# EAGLE design amplifier_ 6_1_Channel_v0001 (EAGLE 6.4)

## Sheet 1 of 3: Amp - Front
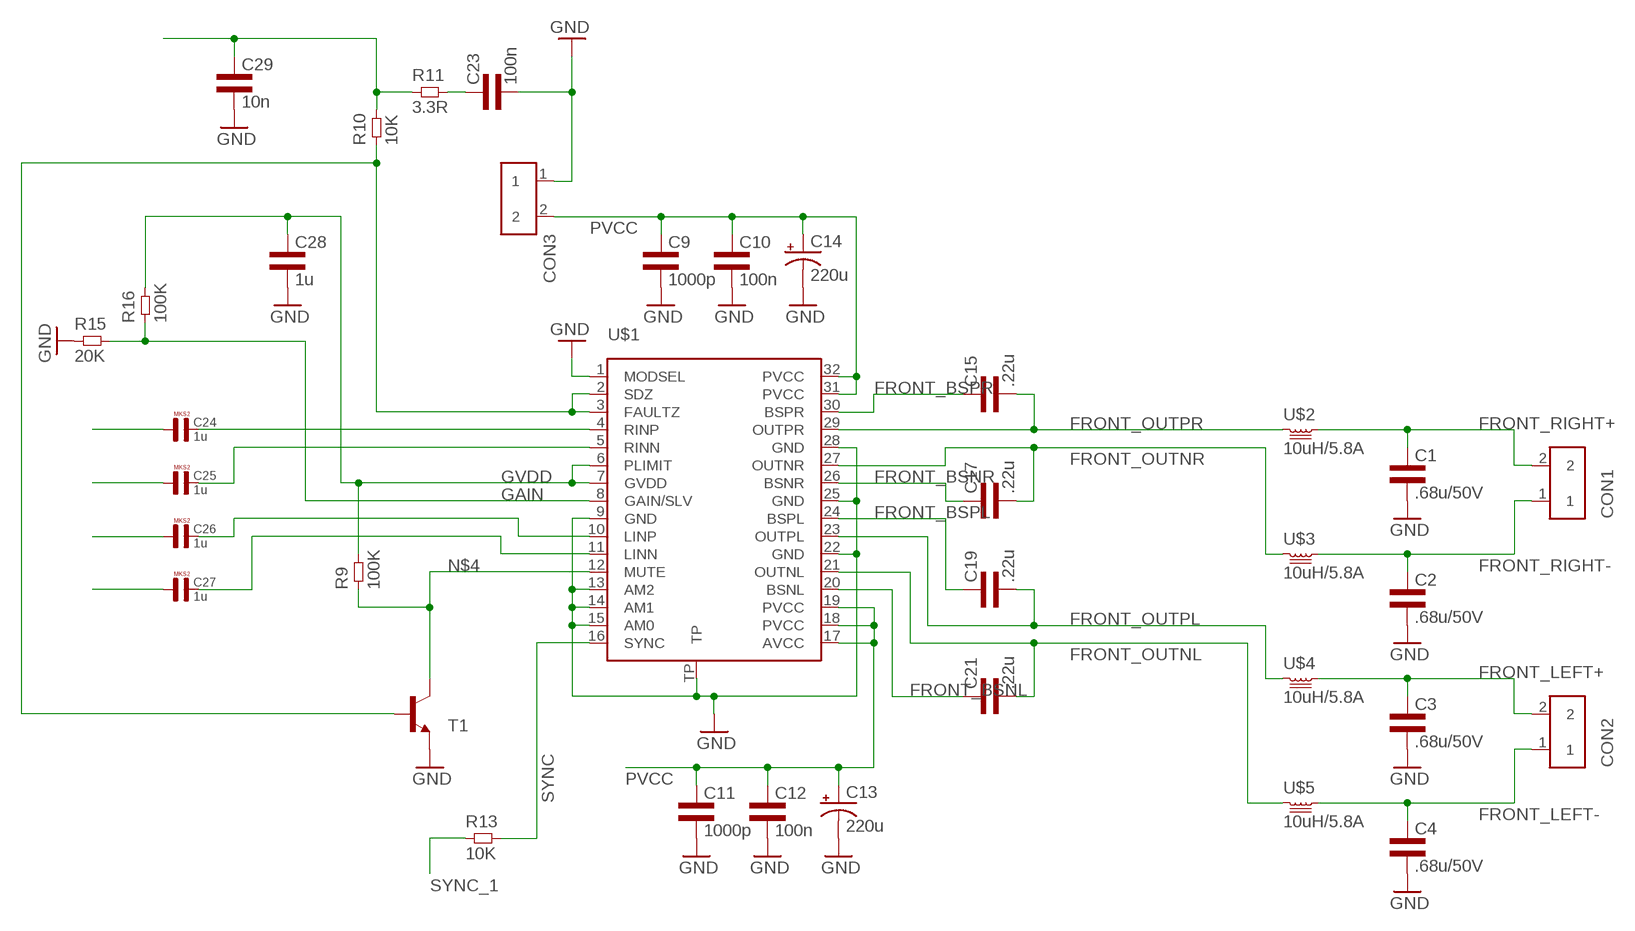
[diagram p0: schematic, sheet 1]

### Parts
C1  .68u/50V  CAP1206L3  [1206L3]
C2  .68u/50V  CAP1206L3  [1206L3]
C3  .68u/50V  CAP1206L3  [1206L3]
C4  .68u/50V  CAP1206L3  [1206L3]
C9  1000p  CAP0603L3  [0603L3]
C10  100n  CAP0603L3  [0603L3]
C11  1000p  CAP0603L3  [0603L3]
C12  100n  CAP0603L3  [0603L3]
C13  220u  CPOL-USG  [PANASONIC_G]
C14  220u  CPOL-USG  [PANASONIC_G]
C15  .22u  CAP0603L3  [0603L3]
C17  .22u  CAP0603L3  [0603L3]
C19  .22u  CAP0603L3  [0603L3]
C21  .22u  CAP0603L3  [0603L3]
C23  100n  CAP0603L3  [0603L3]
C24  1u  3,3µF  [R5B8K5]
C25  1u  3,3µF  [R5B8K5]
C26  1u  3,3µF  [R5B8K5]
C27  1u  3,3µF  [R5B8K5]
C28  1u  CAP0603L3  [0603L3]
C29  10n  CAP0603L3  [0603L3]
CON1  TERM_BLOCK_2  [TERM_BLOCK_2]
CON2  TERM_BLOCK_2  [TERM_BLOCK_2]
CON3  TERM_BLOCK_2  [TERM_BLOCK_2]
R9  100K  RES0603L3  [0603L3]
R10  10K  RES0603L3  [0603L3]
R11  3.3R  RES0603L3  [0603L3]
R13  10K  RES0603L3  [0603L3]
R15  20K  RES0603L3  [0603L3]
R16  100K  RES0603L3  [0603L3]
T1  TRANSISTOR_MMBT2222ALT1-NPN-SOT23-BEC  [TRANSISTOR_SOT23-BEC]
U$1  TPA3116  [R-PDSO-32]
U$2  10uH/5.8A  INDUCTORDR127  [DR127]
U$3  10uH/5.8A  INDUCTORDR127  [DR127]
U$4  10uH/5.8A  INDUCTORDR127  [DR127]
U$5  10uH/5.8A  INDUCTORDR127  [DR127]

### Nets
FRONT_BSNL: C21.P$1 U$1.20(BSNL)
FRONT_BSNR: C17.P$1 U$1.26(BSNR)
FRONT_BSPL: C19.P$1 U$1.24(BSPL)
FRONT_BSPR: C15.P$1 U$1.30(BSPR)
FRONT_LEFT+: C3.1 CON2.2 U$4.2
FRONT_LEFT-: C4.1 CON2.1 U$5.2
FRONT_OUTNL: C21.P$2 U$1.21(OUTNL) U$5.1
FRONT_OUTNR: C17.P$2 U$1.27(OUTNR) U$3.1
FRONT_OUTPL: C19.P$2 U$1.23(OUTPL) U$4.1
FRONT_OUTPR: C15.P$2 U$1.29(OUTPR) U$2.1
FRONT_RIGHT+: C1.1 CON1.2 U$2.2
FRONT_RIGHT-: C2.1 CON1.1 U$3.2
GAIN: R15.P$2 R16.P$1 U$1.8(GAIN/SLV) ; also sheet 2,3
GND: C1.2 C2.2 C3.2 C4.2 C9.P$2 C10.P$2 C11.P$2 C12.P$2 C13.- C14.- C23.P$2 C28.P$2 C29.P$2 CON3.1 R15.P$1 T1.E U$1.1(MODSEL) U$1.9(GND) U$1.13(AM2) U$1.14(AM1) U$1.15(AM0) U$1.22(GND) U$1.25(GND) U$1.28(GND) U$1.TP ; also sheet 2,3
GVDD: C28.P$1 R9.P$2 R16.P$2 U$1.6(PLIMIT) U$1.7(GVDD) ; also sheet 2,3
MUTE: R10.P$1 T1.B U$1.2(SDZ) U$1.3(FAULTZ) ; also sheet 2,3
N$1: C27.2 U$1.11(LINN)
N$2: C26.2 U$1.10(LINP)
N$3: C24.2 U$1.4(RINP)
N$4: R9.P$1 T1.C U$1.12(MUTE)
N$6: C25.2 U$1.5(RINN)
N$7: C29.P$1 R10.P$2 R11.P$1
N$17: C24.1
N$18: C25.1
N$23: C27.1
N$24: C26.1
N$58: C23.P$1 R11.P$2
PVCC: C9.P$1 C10.P$1 C11.P$1 C12.P$1 C13.+ C14.+ CON3.2 U$1.17(AVCC) U$1.18(PVCC) U$1.19(PVCC) U$1.31(PVCC) U$1.32(PVCC) ; also sheet 2,3
SYNC: R13.P$2 U$1.16(SYNC)
SYNC_1: R13.P$1 ; also sheet 2

## Sheet 2 of 3: Amp - Rear
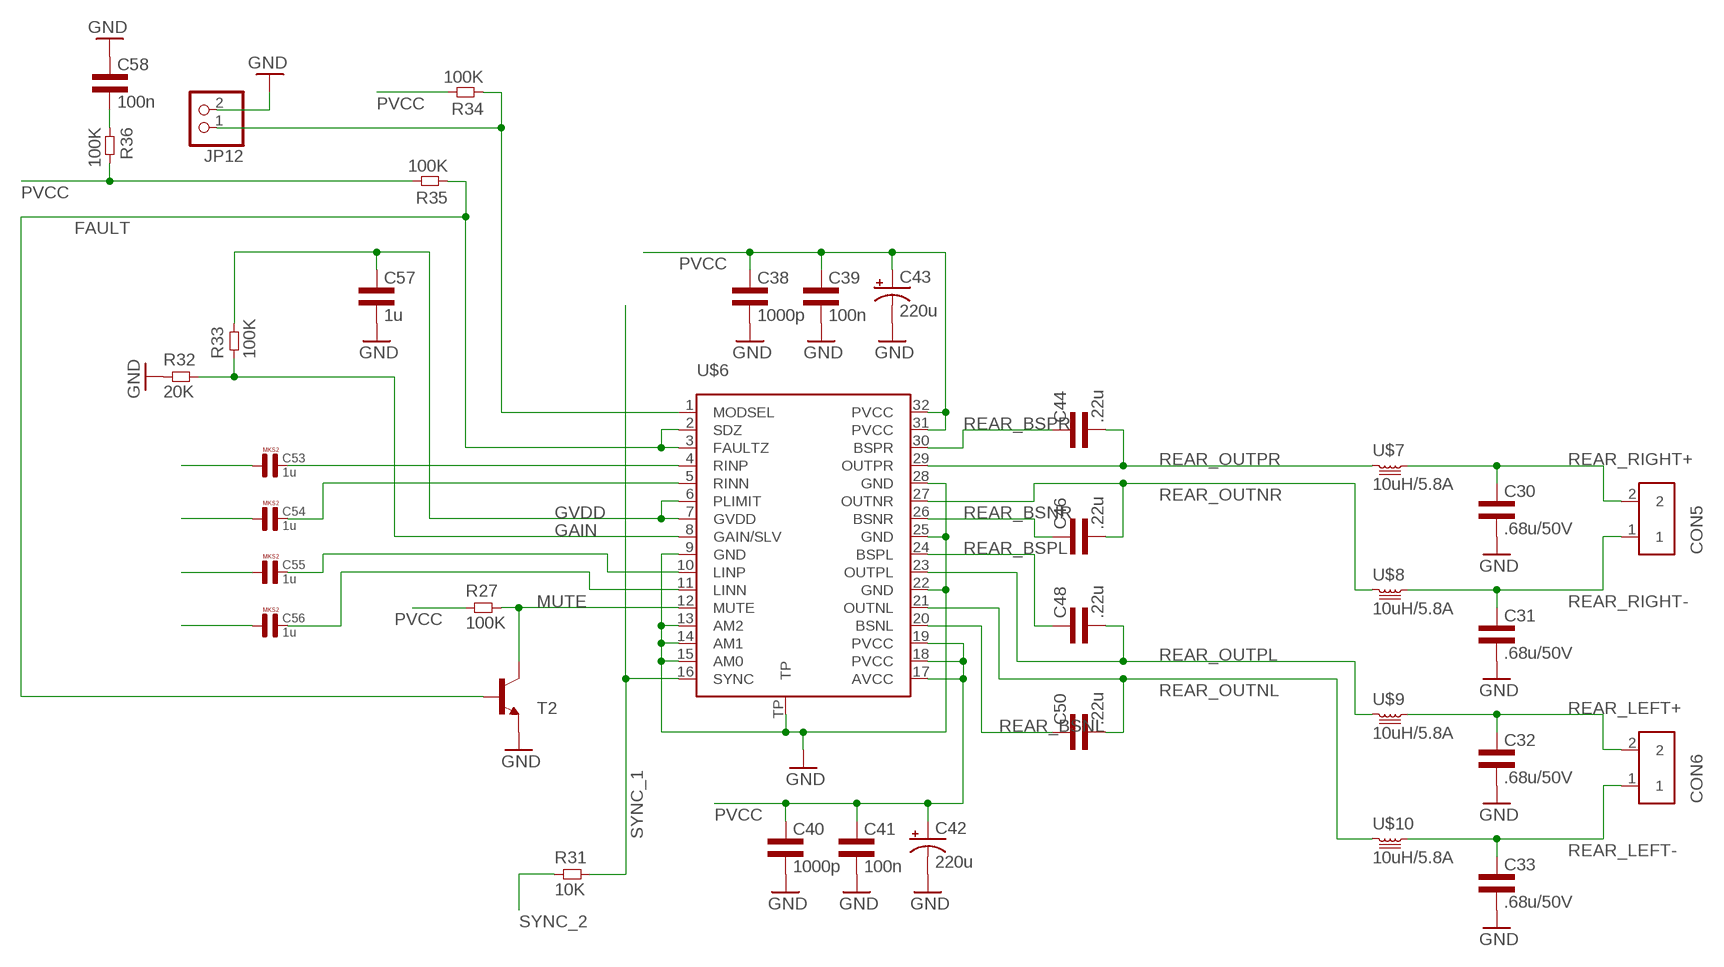
[diagram p1: schematic, sheet 2]

### Parts
C30  .68u/50V  CAP1206L3  [1206L3]
C31  .68u/50V  CAP1206L3  [1206L3]
C32  .68u/50V  CAP1206L3  [1206L3]
C33  .68u/50V  CAP1206L3  [1206L3]
C38  1000p  CAP0603L3  [0603L3]
C39  100n  CAP0603L3  [0603L3]
C40  1000p  CAP0603L3  [0603L3]
C41  100n  CAP0603L3  [0603L3]
C42  220u  CPOL-USG  [PANASONIC_G]
C43  220u  CPOL-USG  [PANASONIC_G]
C44  .22u  CAP0603L3  [0603L3]
C46  .22u  CAP0603L3  [0603L3]
C48  .22u  CAP0603L3  [0603L3]
C50  .22u  CAP0603L3  [0603L3]
C53  1u  3,3µF  [R5B8K5]
C54  1u  3,3µF  [R5B8K5]
C55  1u  3,3µF  [R5B8K5]
C56  1u  3,3µF  [R5B8K5]
C57  1u  CAP0603L3  [0603L3]
C58  100n  CAP0603L3  [0603L3]
CON5  TERM_BLOCK_2  [TERM_BLOCK_2]
CON6  TERM_BLOCK_2  [TERM_BLOCK_2]
JP12  PINHD-1X2  [1X02]
R27  100K  RES0603L3  [0603L3]
R31  10K  RES0603L3  [0603L3]
R32  20K  RES0603L3  [0603L3]
R33  100K  RES0603L3  [0603L3]
R34  100K  RES0603L3  [0603L3]
R35  100K  RES0603L3  [0603L3]
R36  100K  RES0603L3  [0603L3]
T2  TRANSISTOR_MMBT2222ALT1-NPN-SOT23-BEC  [TRANSISTOR_SOT23-BEC]
U$6  TPA3116  [R-PDSO-32]
U$7  10uH/5.8A  INDUCTORDR127  [DR127]
U$8  10uH/5.8A  INDUCTORDR127  [DR127]
U$9  10uH/5.8A  INDUCTORDR127  [DR127]
U$10  10uH/5.8A  INDUCTORDR127  [DR127]

### Nets
FAULT: R35.P$1 T2.B U$6.2(SDZ) U$6.3(FAULTZ) ; also sheet 3
GAIN: R32.P$2 R33.P$1 U$6.8(GAIN/SLV) ; also sheet 1,3
GND: C30.2 C31.2 C32.2 C33.2 C38.P$2 C39.P$2 C40.P$2 C41.P$2 C42.- C43.- C57.P$2 C58.P$1 JP12.2 R32.P$1 T2.E U$6.9(GND) U$6.13(AM2) U$6.14(AM1) U$6.15(AM0) U$6.22(GND) U$6.25(GND) U$6.28(GND) U$6.TP ; also sheet 1,3
GVDD: C57.P$1 R33.P$2 U$6.6(PLIMIT) U$6.7(GVDD) ; also sheet 1,3
MUTE: R27.P$2 T2.C U$6.12(MUTE) ; also sheet 1,3
N$29: C56.2 U$6.11(LINN)
N$30: C55.2 U$6.10(LINP)
N$31: C53.2 U$6.4(RINP)
N$32: C54.2 U$6.5(RINN)
N$33: C53.1
N$34: C54.1
N$35: C56.1
N$36: C55.1
N$37: JP12.1 R34.P$1 U$6.1(MODSEL)
N$38: C58.P$2 R36.P$1
PVCC: C38.P$1 C39.P$1 C40.P$1 C41.P$1 C42.+ C43.+ R27.P$1 R34.P$2 R35.P$2 R36.P$2 U$6.17(AVCC) U$6.18(PVCC) U$6.19(PVCC) U$6.31(PVCC) U$6.32(PVCC) ; also sheet 1,3
REAR_BSNL: C50.P$1 U$6.20(BSNL)
REAR_BSNR: C46.P$1 U$6.26(BSNR)
REAR_BSPL: C48.P$1 U$6.24(BSPL)
REAR_BSPR: C44.P$1 U$6.30(BSPR)
REAR_LEFT+: C32.1 CON6.2 U$9.2
REAR_LEFT-: C33.1 CON6.1 U$10.2
REAR_OUTNL: C50.P$2 U$6.21(OUTNL) U$10.1
REAR_OUTNR: C46.P$2 U$6.27(OUTNR) U$8.1
REAR_OUTPL: C48.P$2 U$6.23(OUTPL) U$9.1
REAR_OUTPR: C44.P$2 U$6.29(OUTPR) U$7.1
REAR_RIGHT+: C30.1 CON5.2 U$7.2
REAR_RIGHT-: C31.1 CON5.1 U$8.2
SYNC_1: R31.P$2 U$6.16(SYNC) ; also sheet 1
SYNC_2: R31.P$1 ; also sheet 3

## Sheet 3 of 3: Amp - Center
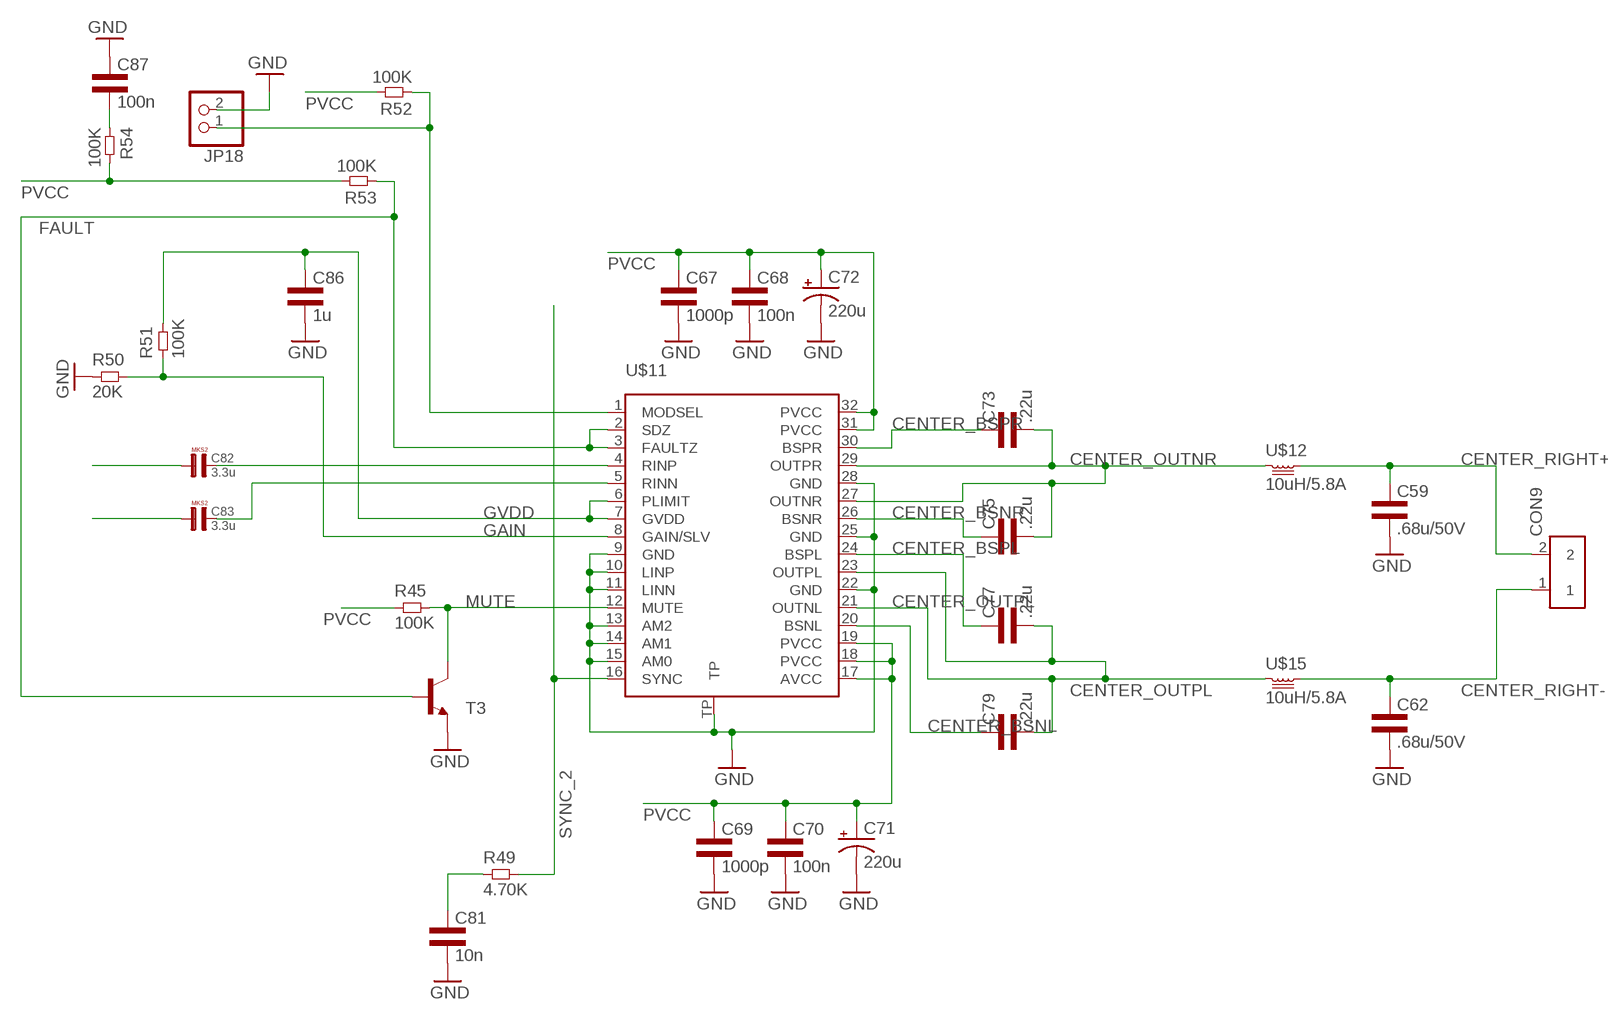
[diagram p2: schematic, sheet 3]

### Parts
C59  .68u/50V  CAP1206L3  [1206L3]
C62  .68u/50V  CAP1206L3  [1206L3]
C67  1000p  CAP0603L3  [0603L3]
C68  100n  CAP0603L3  [0603L3]
C69  1000p  CAP0603L3  [0603L3]
C70  100n  CAP0603L3  [0603L3]
C71  220u  CPOL-USG  [PANASONIC_G]
C72  220u  CPOL-USG  [PANASONIC_G]
C73  .22u  CAP0603L3  [0603L3]
C75  .22u  CAP0603L3  [0603L3]
C77  .22u  CAP0603L3  [0603L3]
C79  .22u  CAP0603L3  [0603L3]
C81  10n  CAP0603L3  [0603L3]
C82  3.3u  3,3µF  [R5B8K5]
C83  3.3u  3,3µF  [R5B8K5]
C86  1u  CAP0603L3  [0603L3]
C87  100n  CAP0603L3  [0603L3]
CON9  TERM_BLOCK_2  [TERM_BLOCK_2]
JP18  PINHD-1X2  [1X02]
R45  100K  RES0603L3  [0603L3]
R49  4.70K  RES0603L3  [0603L3]
R50  20K  RES0603L3  [0603L3]
R51  100K  RES0603L3  [0603L3]
R52  100K  RES0603L3  [0603L3]
R53  100K  RES0603L3  [0603L3]
R54  100K  RES0603L3  [0603L3]
T3  TRANSISTOR_MMBT2222ALT1-NPN-SOT23-BEC  [TRANSISTOR_SOT23-BEC]
U$11  TPA3116  [R-PDSO-32]
U$12  10uH/5.8A  INDUCTORDR127  [DR127]
U$15  10uH/5.8A  INDUCTORDR127  [DR127]

### Nets
CENTER_BSNL: C79.P$1 U$11.20(BSNL)
CENTER_BSNR: C75.P$1 U$11.26(BSNR)
CENTER_BSPL: C77.P$1 U$11.24(BSPL)
CENTER_BSPR: C73.P$1 U$11.30(BSPR)
CENTER_OUTNR: C73.P$2 C75.P$2 U$11.27(OUTNR) U$11.29(OUTPR) U$12.1
CENTER_OUTPL: C77.P$2 C79.P$2 U$11.21(OUTNL) U$11.23(OUTPL) U$15.1
CENTER_RIGHT+: C59.1 CON9.2 U$12.2
CENTER_RIGHT-: C62.1 CON9.1 U$15.2
FAULT: R53.P$1 T3.B U$11.2(SDZ) U$11.3(FAULTZ) ; also sheet 2
GAIN: R50.P$2 R51.P$1 U$11.8(GAIN/SLV) ; also sheet 1,2
GND: C59.2 C62.2 C67.P$2 C68.P$2 C69.P$2 C70.P$2 C71.- C72.- C81.P$2 C86.P$2 C87.P$1 JP18.2 R50.P$1 T3.E U$11.9(GND) U$11.10(LINP) U$11.11(LINN) U$11.13(AM2) U$11.14(AM1) U$11.15(AM0) U$11.22(GND) U$11.25(GND) U$11.28(GND) U$11.TP ; also sheet 1,2
GVDD: C86.P$1 R51.P$2 U$11.6(PLIMIT) U$11.7(GVDD) ; also sheet 1,2
MUTE: R45.P$2 T3.C U$11.12(MUTE) ; also sheet 1,2
N$50: C82.2 U$11.4(RINP)
N$51: C83.2 U$11.5(RINN)
N$52: C82.1
N$53: C83.1
N$56: JP18.1 R52.P$1 U$11.1(MODSEL)
N$57: C87.P$2 R54.P$1
PVCC: C67.P$1 C68.P$1 C69.P$1 C70.P$1 C71.+ C72.+ R45.P$1 R52.P$2 R53.P$2 R54.P$2 U$11.17(AVCC) U$11.18(PVCC) U$11.19(PVCC) U$11.31(PVCC) U$11.32(PVCC) ; also sheet 1,2
SYNC_2: R49.P$2 U$11.16(SYNC) ; also sheet 2
SYNC_3: C81.P$1 R49.P$1

## Library data of the parts
C1-C4 C9-C12 C15 C17 C19 C21 C23 C28-C33 C38-C41 C44 C46 C48 C50 C57-C59 C62 C67-C70 C73 C75 C77 C79 C81 C86 C87 = common:CAP
C13 C14 C42 C43 C71 C72 = rcl:CPOL-US: POLARIZED CAPACITOR, American symbol
C24-C27 C53-C56 C82 C83 = Capacitor-Wima-MKS2-63v:3,3µF
CON1-CON3 CON5 CON6 CON9 = common:TERM_BLOCK_2
JP12 JP18 = pinhead:PINHD-1X2: PIN HEADER
R9-R11 R13 R15 R16 R27 R31-R36 R45 R49-R54 = common:RES
T1-T3 = logic:TRANSISTOR_*-NPN-: NPN Transistror BF959 corrected 2008.03.06
U$1 U$6 U$11 = common:TPA3116: TPA3116D2 15-W, 30-W, 50-W Filter-Free Class-D Stereo Amplifier Family With AM Avoidance
U$2-U$5 U$7-U$10 U$12 U$15 = common:INDUCTOR

## Board
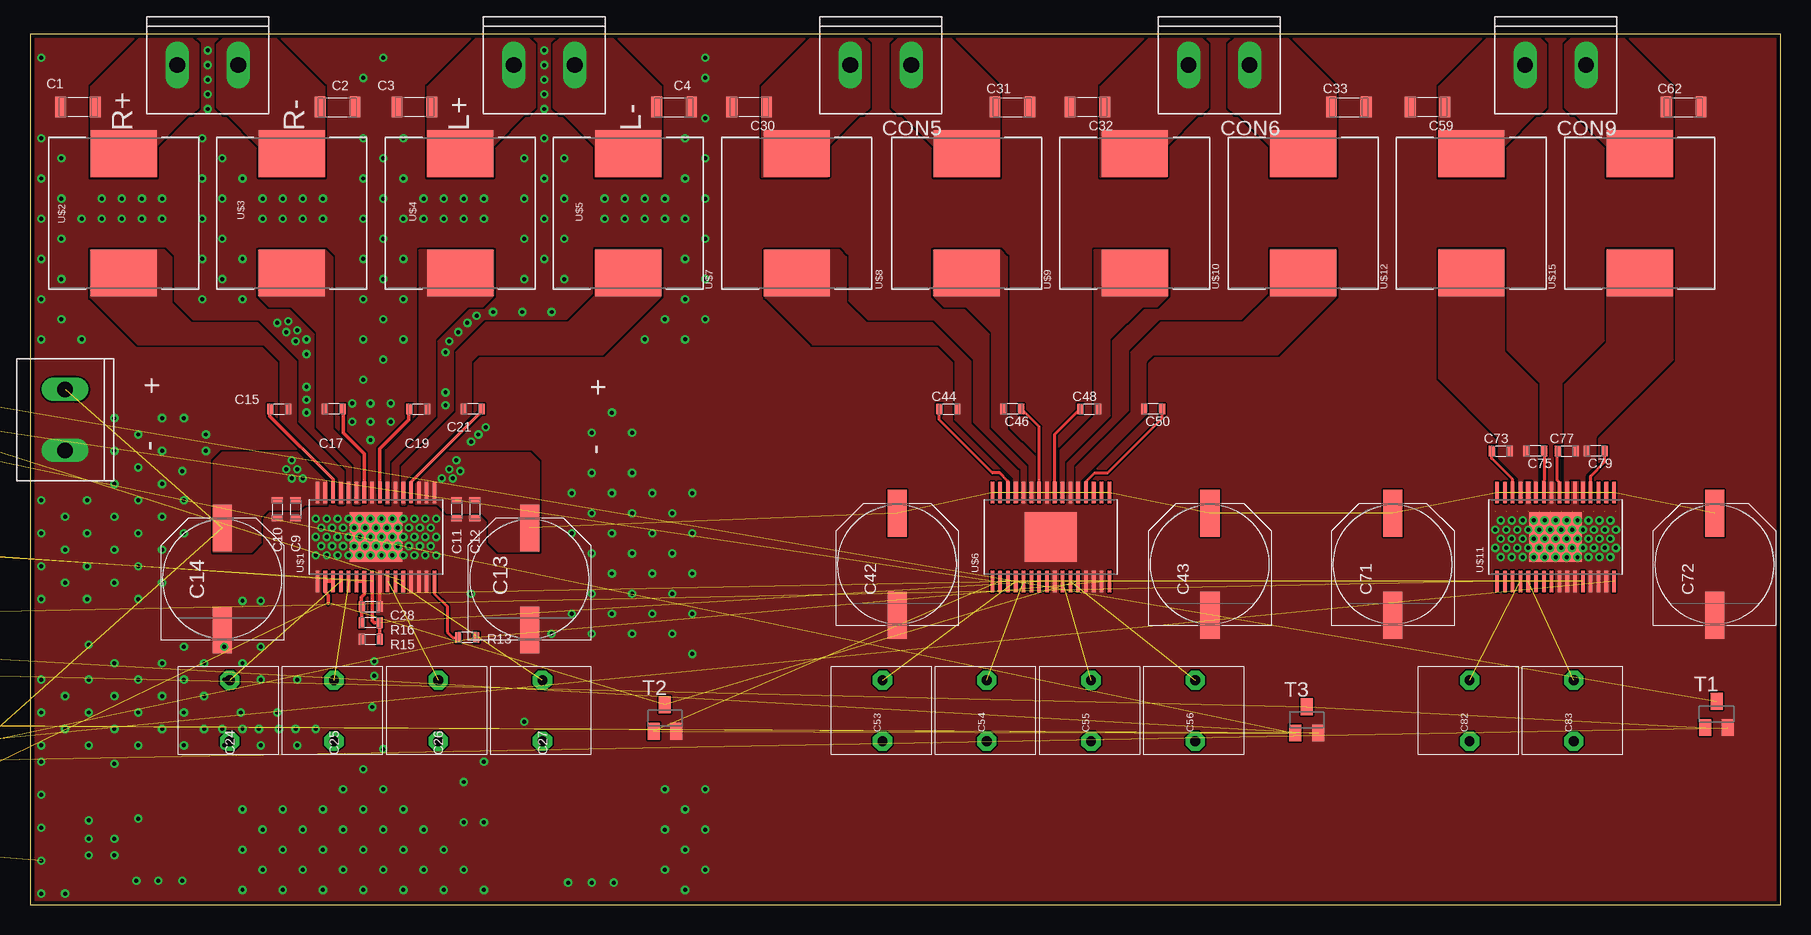
[diagram p3: board, top side]
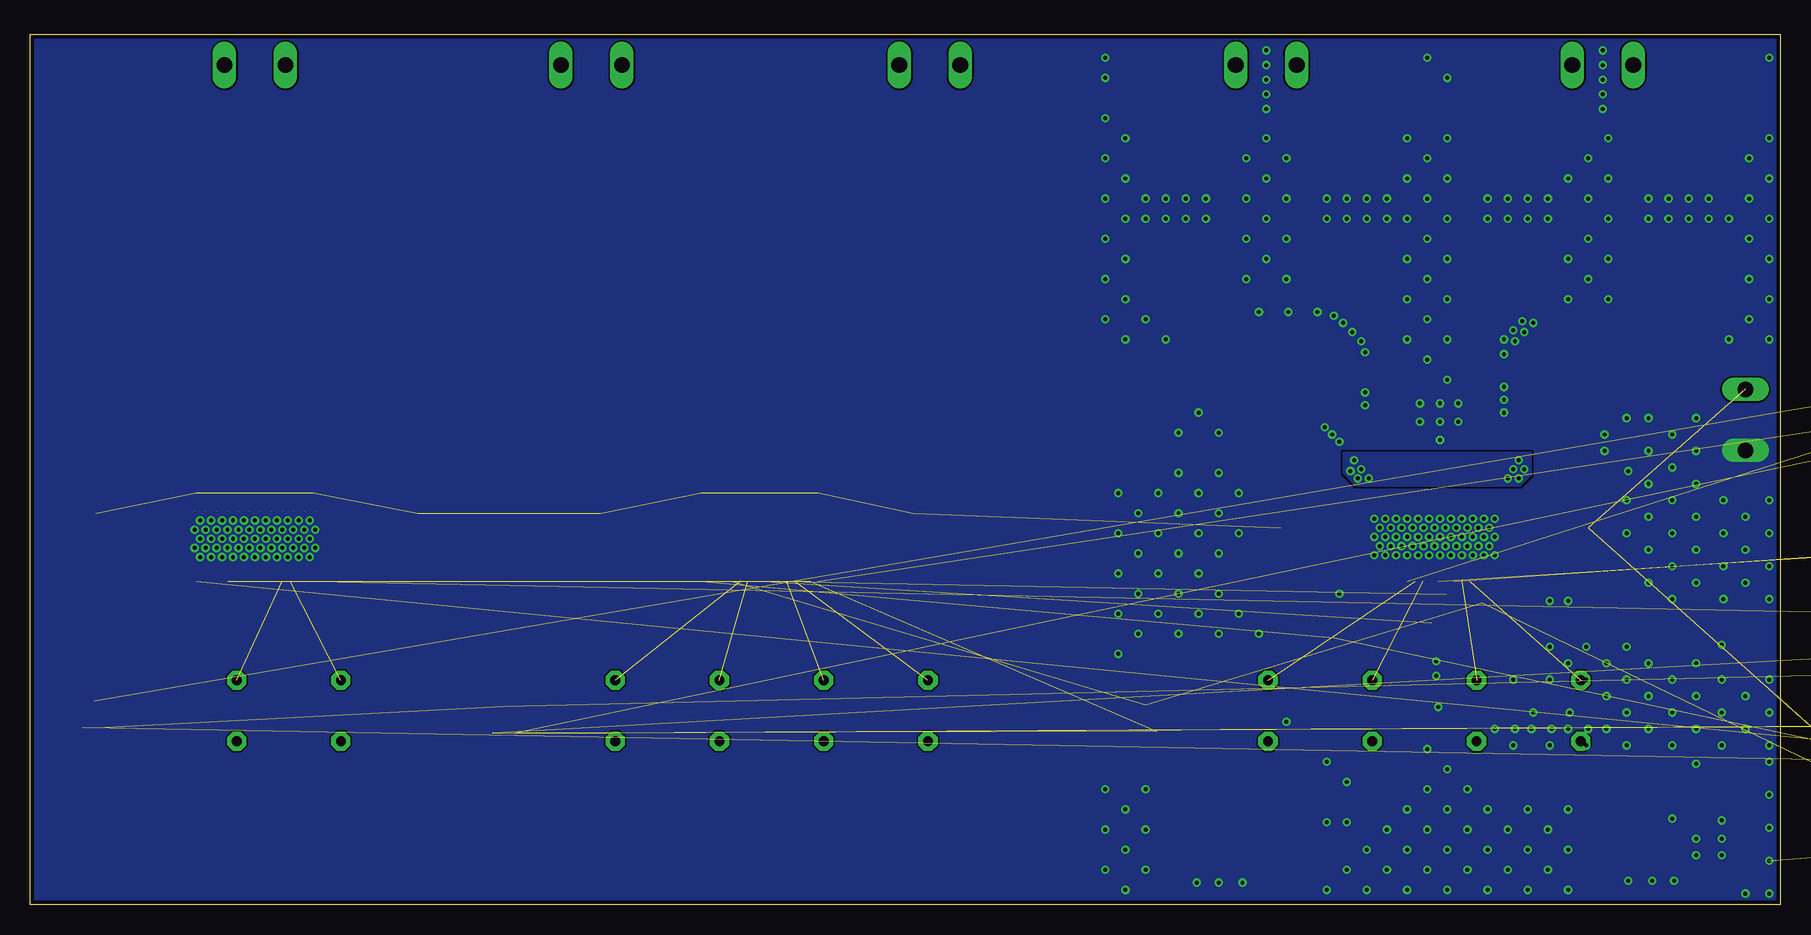
[diagram p4: board, bottom side, seen from below]

Size 145.85 x 72.54 mm. Coordinates in mm from the lower left corner, seen from the top.
Outline: 145.85,72.54 0,72.54 0,0 145.85,0 145.85,72.54
Copper layers (1*16): Top 0.035mm / dielectric 1.5mm / Bottom 0.035mm
Design rules "default *": minimum track width 6mil, minimum drill 13mil, track to track 6mil, track to pad 6mil, pad to pad 6mil, via to via 6mil, smd to smd 6mil, copper to edge 13mil, drill to drill 6mil, minimum pad ring 7mil, minimum via ring 7mil, stop-mask expansion 4mil, vias tented up to drill 16mil, thermal gap 10mil

### Footprints (pad centres in the part's own frame; a part is rotated, then mirrored left to right if it is on the bottom)
1206L3 = smd 0.9 x 1.7: 1 -1.45,0; 2 1.45,0
0603L3 = smd 0.5 x 0.9: P$1 -0.75,0; P$2 0.75,0
PANASONIC_G = smd 3.9 x 1.6: + 4.25,0; - -4.25,0
R5B8K5 = drill 0.813 pad 1.6 octagon: 1 -2.54,0; 2 2.54,0
TERM_BLOCK_2 = drill 1.3 long: 1 -2.54,0; 2 2.54,0
1X02 = drill 1.016 long: 1 -1.27,0; 2 1.27,0
TRANSISTOR_SOT23-BEC = smd 1 x 1.4: B -0.95,-1.1; C 0,1.1; E 0.95,-1.1
R-PDSO-32 = smd 0.3 x 1.8: 1 -4.875,-3.7; 2 -4.225,-3.7; 3 -3.575,-3.7; 4 -2.925,-3.7; 5 -2.275,-3.7; 6 -1.625,-3.7; 7 -0.975,-3.7; 8 -0.325,-3.7; 9 0.325,-3.7; 10 0.975,-3.7; 11 1.625,-3.7; 12 2.275,-3.7; 13 2.925,-3.7; 14 3.575,-3.7; 15 4.225,-3.7; 16 4.875,-3.7; 17 4.875,3.7; 18 4.225,3.7; 19 3.575,3.7; 20 2.925,3.7; 21 2.275,3.7; 22 1.625,3.7; 23 0.975,3.7; 24 0.325,3.7; 25 -0.325,3.7; 26 -0.975,3.7; 27 -1.625,3.7; 28 -2.275,3.7; 29 -2.925,3.7; 30 -3.575,3.7; 31 -4.225,3.7; 32 -4.875,3.7 | smd 4.36 x 4.11: TP 0,0
DR127 = smd 3.85 x 5.5: 1 -4.975,0; 2 4.975,0

### Placement (x,y rotation side)
C1  3.96,66.45 180 top
C2  25.6,66.45 0 top
C3  32,66.45 180 top
C4  53.64,66.45 0 top
C9  22.1,32.92 270 top
C10  20.57,32.92 270 top
C11  35.51,32.92 270 top
C12  37.03,32.92 270 top
C13  41.61,27.13 90 top
C14  16,27.13 90 top
C15  20.73,41.3 0 top
C17  25.3,41.3 180 top
C19  32.31,41.3 0 top
C21  36.88,41.3 180 top
C23  -20.57,45.11 270 top  (outside the outline)
C24  16.61,16.15 90 top
C25  25.3,16.15 90 top
C26  33.99,16.15 90 top
C27  42.67,16.15 90 top
C28  28.35,24.84 0 top
C29  -24.38,45.11 270 top  (outside the outline)
C30  59.89,66.45 180 top
C31  81.84,66.45 0 top
C32  88.09,66.45 180 top
C33  109.88,66.45 0 top
C38  -35.51,52.12 0 top  (outside the outline)
C39  -45.72,47.7 0 top  (outside the outline)
C40  -31.39,52.12 0 top  (outside the outline)
C41  -42.21,47.7 0 top  (outside the outline)
C42  72.24,28.35 90 top
C43  98.3,28.35 90 top
C44  76.5,41.3 0 top
C46  81.84,41.3 180 top
C48  88.24,41.3 0 top
C50  93.57,41.3 180 top
C53  71.02,16.15 90 top
C54  79.71,16.15 90 top
C55  88.39,16.15 90 top
C56  97.08,16.15 90 top
C57  -47.55,43.89 0 top  (outside the outline)
C58  -36.42,47.09 0 top  (outside the outline)
C59  116.43,66.45 180 top
C62  137.77,66.45 0 top
C67  -34.9,19.51 0 top  (outside the outline)
C68  -45.11,15.09 0 top  (outside the outline)
C69  -30.78,19.51 0 top  (outside the outline)
C70  -41.61,15.09 0 top  (outside the outline)
C71  113.54,28.35 90 top
C72  140.36,28.35 90 top
C73  122.53,37.8 0 top
C75  125.43,37.8 180 top
C77  128.02,37.8 0 top
C79  130.45,37.8 180 top
C81  -15.24,4.88 0 top  (outside the outline)
C82  119.94,16.15 90 top
C83  128.63,16.15 90 top
C86  -46.94,11.28 0 top  (outside the outline)
C87  -24.08,15.09 0 top  (outside the outline)
CON1  14.78,69.95 180 top
CON2  42.82,69.95 180 top
CON3  2.9,40.39 90 top
CON5  70.87,69.95 180 top
CON6  99.06,69.95 180 top
CON9  127.1,69.95 180 top
JP12  -55.47,55.93 0 top  (outside the outline)
JP18  -54.86,23.32 0 top  (outside the outline)
R9  -28.19,45.11 270 top  (outside the outline)
R10  -12.95,45.11 270 top  (outside the outline)
R11  -16.76,45.11 270 top  (outside the outline)
R13  36.42,22.25 180 top
R15  28.35,22.1 0 top
R16  28.35,23.47 180 top
R27  -7.16,10.06 0 top  (outside the outline)
R31  -4.42,13.56 0 top  (outside the outline)
R32  -32.31,43.89 0 top  (outside the outline)
R33  -8.69,52.12 0 top  (outside the outline)
R34  -56.69,47.7 0 top  (outside the outline)
R35  -53.04,47.7 0 top  (outside the outline)
R36  -49.38,47.7 0 top  (outside the outline)
R45  -22.71,19.51 0 top  (outside the outline)
R49  -26.67,19.51 0 top  (outside the outline)
R50  -31.7,11.28 0 top  (outside the outline)
R51  -14.48,29.72 0 top  (outside the outline)
R52  -56.08,15.09 0 top  (outside the outline)
R53  -52.43,15.09 0 top  (outside the outline)
R54  -48.77,15.09 0 top  (outside the outline)
T1  140.51,15.85 0 top
T2  52.88,15.54 0 top
T3  106.38,15.39 0 top
U$1  28.8,30.63 0 top
U$2  7.77,57.61 90 top
U$3  21.79,57.61 90 top
U$4  35.81,57.61 90 top
U$5  49.83,57.61 90 top
U$6  85.04,30.63 0 top
U$7  63.86,57.61 90 top
U$8  78.03,57.61 90 top
U$9  92.05,57.61 90 top
U$10  106.07,57.61 90 top
U$11  127.1,30.63 0 top
U$12  120.09,57.61 90 top
U$15  134.11,57.61 90 top

### Tracks (layer width: path | path; a pad name or v marks a point on that pad's centre or on a via)
CENTER_BSNL
  Top 0.254: U$11.20 130.03,35.69 131.22,36.88 C79.P$1
CENTER_BSNR
  Top 0.254: U$11.26 126.13,35.3 126.19,35.36 C75.P$1
CENTER_BSPL
  Top 0.254: U$11.24 127.43,35.18 127.25,35.36 127.25,37.78 C77.P$1
CENTER_BSPR
  Top 0.254: U$11.30 123.53,35.43 121.77,37.19 C73.P$1
CENTER_OUTNR
  pour Top (no thermals): 125.58,33.53 125.58,43.28 122.83,46.02 122.83,54.56 117.35,54.56 117.35,43.89 122.38,38.86 122.38,37.19 124.05,35.51 124.05,33.53 124.36,33.53 124.36,35.51 125.27,35.51 125.27,33.53
CENTER_OUTPL
  pour Top (no thermals): 131.37,54.56 131.37,46.79 127.86,43.28 127.86,33.53 128.17,33.53 128.17,35.51 129.24,35.51 129.24,33.53 129.54,33.53 129.54,35.81 130.45,36.73 130.45,39.01 136.86,45.42 136.86,54.56
CENTER_RIGHT+
  pour Top (no thermals): 122.83,60.66 122.83,63.25 125.43,65.84 125.73,65.84 126.34,66.45 126.34,71.63 125.73,72.24 121.46,72.24 117.35,68.12 117.35,60.66
CENTER_RIGHT-
  pour Top (no thermals): 136.86,60.66 136.86,68.12 132.74,72.24 128.47,72.24 127.86,71.63 127.86,66.45 128.47,65.84 128.78,65.84 131.37,63.25 131.37,60.66
FAULT  (7 unrouted)
FRONT_BSNL
  Top 0.305: U$1.20 31.73,35.23 37.64,41.15 37.64,41.29 C21.P$1
FRONT_BSNR
  Top 0.305: U$1.26 27.83,37.55 26.06,39.32 26.06,41.29 C17.P$1
FRONT_BSPL
  Top 0.305: U$1.24 29.13,37.97 31.55,40.39 31.55,41.29 C19.P$1
FRONT_BSPR
  Top 0.305: U$1.30 25.23,35.43 19.96,40.69 19.96,41.29 C15.P$1
FRONT_LEFT+
  pour Top (no thermals): 38.56,60.66 38.56,63.25 41.15,65.84 41.45,65.84 42.06,66.45 42.06,71.63 41.45,72.24 37.19,72.24 33.07,68.12 33.07,60.66
FRONT_LEFT-
  pour Top (no thermals): 52.58,60.66 52.58,68.12 48.46,72.24 44.2,72.24 43.59,71.63 43.59,66.45 44.2,65.84 44.5,65.84 47.09,63.25 47.09,60.66
FRONT_OUTNL
  pour Top (no thermals): 31.24,33.38 31.24,35.36 36.73,40.84 36.73,45.26 37.34,45.87 47.7,45.87 52.58,50.75 52.58,54.56 47.09,54.56 47.09,50.75 44.81,48.46 37.95,48.46 35.51,46.02 35.51,41 30.94,36.42 30.94,33.38
FRONT_OUTNR
  pour Top (no thermals): 27.05,33.38 27.05,36.65 23.93,39.78 23.93,47.7 21.79,49.83 19.96,49.83 19.05,50.75 19.05,54.56 24.54,54.56 25.15,53.95 25.15,39.62 27.43,37.34 27.43,33.38
FRONT_OUTPL
  pour Top (no thermals): 29.64,33.38 29.64,37.87 32.46,40.69 32.46,54.56 38.56,54.56 38.56,50.75 37.64,49.83 36.42,49.83 33.68,47.09 33.68,40.69 29.87,36.88 29.87,33.38
FRONT_OUTPR
  pour Top (no thermals): 25.76,33.38 25.76,35.51 20.88,40.39 20.88,45.26 19.51,46.63 8.99,46.63 5.03,50.6 5.03,54.56 11.13,54.56 11.73,53.95 11.73,50.14 13.41,48.46 18.9,48.46 22.1,45.26 22.1,40.08 26.06,36.12 26.06,33.38
FRONT_RIGHT+
  pour Top (no thermals): 10.52,60.66 10.52,63.25 13.11,65.84 13.41,65.84 14.02,66.45 14.02,71.63 13.41,72.24 9.14,72.24 5.03,68.12 5.03,60.66
FRONT_RIGHT-
  pour Top (no thermals): 24.54,60.66 24.54,68.12 20.42,72.24 16.15,72.24 15.54,71.63 15.54,66.45 16.15,65.84 16.46,65.84 19.05,63.25 19.05,60.66
GAIN  (6 unrouted)
  Top 0.305: R15.P$2 29.1,23.32 | 29.1,23.32 R16.P$1 | U$1.8 28.48,23.64 28.65,23.47 28.94,23.47 29.1,23.32
GND  (via drill 0.33)  (33 unrouted)
  Top 0.305: U$1.9 29.13,24.87 C28.P$2
  other vias: 23.01,42.06 23.01,43.13 27.43,29.11 28.35,29.11 29.26,29.11 30.18,29.11 27.89,29.87 28.8,29.87 29.72,29.87 30.63,29.87 26.97,29.87 27.43,30.63 28.35,30.63 29.26,30.63 30.18,30.63 26.97,31.39 27.89,31.39 28.8,31.39 29.72,31.39 30.63,31.39 30.18,32.16 29.26,32.16 28.35,32.16 27.43,32.16 26.52,29.11 25.6,29.11 24.69,29.11 23.77,29.11 26.06,29.87 25.15,29.87 24.23,29.87 23.77,30.63 24.69,30.63 25.6,30.63 26.52,30.63 24.23,31.39 25.15,31.39 26.06,31.39 23.77,32.16 24.69,32.16 25.6,32.16 26.52,32.16 31.09,29.11 32,29.11 32.92,29.11 33.83,29.11 31.55,29.87 32.46,29.87 33.38,29.87 31.09,30.63 32,30.63 32.92,30.63 33.83,30.63 31.55,31.39 32.46,31.39 33.38,31.39 31.09,32.16 32,32.16 32.92,32.16 33.83,32.16 23.01,41 28.35,38.71 28.35,40.23 26.82,40.23 30.02,40.23 28.35,41.76 26.82,41.76 30.02,41.76 37.95,39.78 37.34,39.17 36.73,38.56 34.59,41.61 34.59,42.67 34.59,46.02 34.9,46.94 35.66,47.7 36.42,48.46 37.19,49.07 38.56,49.38 41,49.38 43.43,49.38 42.82,66.29 42.82,67.51 42.82,68.73 42.82,69.95 42.82,71.17 14.78,71.17 14.78,69.95 14.78,68.73 14.78,67.51 14.78,66.29 23.01,45.87 23.01,47.09 22.25,47.85 22.25,47.85 21.49,48.62 22.1,46.94 21.34,47.7 20.57,48.46 0.91,0.91 0.91,3.66 0.91,6.4 0.91,9.14 0.91,11.89 0.91,13.26 0.91,16 0.91,25.45 0.91,28.19 0.91,30.94 0.91,33.68 2.9,0.91 2.9,14.63 2.9,17.37 4.88,13.26 4.88,16 2.9,26.82 2.9,29.57 2.9,32.31 4.72,28.19 4.72,30.94 4.72,33.68 7.01,29.57 7.01,32.31 7.01,14.63 7.01,17.37 8.99,33.68 8.99,30.94 8.99,28.19 4.72,25.45 7.01,26.82 8.99,25.45 10.97,26.82 10.97,29.57 10.97,32.31 12.8,33.68 12.8,30.94 8.99,13.26 8.99,16 10.97,17.37 10.97,14.63 12.8,16 12.8,13.26 14.48,14.63 14.48,17.37 16.15,13.26 16,14.63 17.53,16 17.68,14.63 7.01,35.05 7.01,37.8 7.01,40.54 8.99,36.42 8.99,39.17 10.97,35.05 10.97,37.8 10.97,40.54 12.8,40.54 14.63,37.8 14.63,39.17 12.65,36.12 19.2,13.26 19.05,14.63 20.73,14.63 20.57,16 22.25,13.26 22.1,14.63 0.91,18.75 4.88,18.75 8.99,18.75 12.8,18.75 16.15,18.75 19.2,18.75 22.25,18.75 4.88,21.64 7.01,20.12 23.77,14.63 19.2,21.49 17.68,20.12 16.15,21.49 14.48,20.12 12.8,21.49 10.97,20.12 7.01,11.73 17.68,25.3 19.2,25.3 4.88,7.01 4.88,5.49 4.88,4.11 7.01,5.49 7.01,4.11 8.84,1.98 8.99,7.16 36.73,25.91 45.11,30.94 46.79,32.61 48.46,34.29 45.11,34.29 46.79,35.97 46.79,29.26 48.46,30.94 50.14,32.61 51.82,34.29 43.43,22.56 45.11,24.23 46.79,25.91 48.46,27.58 50.14,29.26 51.82,30.94 53.49,32.61 55.17,34.29 55.17,30.94 55.17,27.58 55.17,24.23 55.17,20.88 53.49,29.26 53.49,25.91 53.49,22.56 51.82,24.23 51.82,27.58 50.14,25.91 48.46,24.23 46.79,22.56 50.14,22.56 17.68,1.22 17.68,4.57 19.35,2.9 17.68,7.92 19.35,6.25 21.03,1.22 21.03,4.57 21.03,7.92 22.71,2.9 22.71,6.25 24.38,1.22 24.38,4.57 24.38,7.92 26.06,2.9 26.06,6.25 27.74,7.92 27.74,4.57 27.74,1.22 27.74,11.28 29.41,2.9 29.41,6.25 29.41,9.6 31.09,1.22 31.09,4.57 31.09,7.92 32.77,2.9 32.77,6.25 34.44,1.22 34.44,4.57 36.12,2.9 37.8,1.22 26.06,9.6 29.41,12.95 54.56,1.22 52.88,2.9 54.56,4.57 52.88,6.25 54.56,7.92 52.88,9.6 56.24,6.25 56.24,2.9 56.24,9.6 50.14,35.97 50.14,39.32 48.46,41 46.79,39.32 0.91,47.09 2.59,48.77 0.91,50.44 2.59,52.12 0.91,53.8 2.59,55.47 0.91,57.15 2.59,58.83 0.91,60.5 2.59,62.18 0.91,63.86 4.27,57.15 5.94,58.83 9.3,58.83 10.97,57.15 14.33,53.8 14.33,50.44 16,52.12 17.68,50.44 17.68,53.8 16,55.47 14.33,57.15 14.33,60.5 14.33,63.86 16,58.83 16,62.18 17.68,60.5 19.35,57.15 21.03,57.15 22.71,57.15 24.38,57.15 19.35,58.83 21.03,58.83 22.71,58.83 24.38,58.83 27.74,43.74 27.74,47.09 27.74,50.44 27.74,53.8 27.74,57.15 27.74,60.5 27.74,63.86 29.41,45.42 29.41,48.77 29.41,52.12 29.41,55.47 29.41,58.83 29.41,62.18 31.09,47.09 31.09,50.44 31.09,53.8 31.09,57.15 31.09,60.5 31.09,63.86 32.77,57.15 34.44,57.15 36.12,57.15 37.8,57.15 32.77,58.83 34.44,58.83 36.12,58.83 37.8,58.83 41.15,52.12 41.15,55.47 41.15,58.83 41.15,62.18 42.82,53.8 42.82,57.15 42.82,60.5 42.82,63.86 44.5,52.12 44.5,55.47 44.5,58.83 44.5,62.18 47.85,57.15 47.85,58.83 49.53,58.83 51.21,58.83 51.21,57.15 49.53,57.15 52.88,57.15 52.88,58.83 51.21,47.09 54.56,47.09 52.88,48.77 56.24,48.77 54.56,50.44 54.56,53.8 54.56,57.15 54.56,60.5 54.56,63.86 56.24,52.12 56.24,55.47 56.24,58.83 56.24,62.18 56.24,65.53 56.24,70.56 56.24,68.88 29.41,70.56 27.74,68.88 5.94,57.15 7.62,57.15 9.3,57.15 7.62,58.83 10.97,58.83 36.12,6.86 37.8,6.86 36.12,10.21 37.8,11.89 4.27,47.09 0.91,70.56 41.15,15.24 28.65,20.27 28.65,19.05 28.5,16.46 44.81,1.83 46.79,1.83 48.62,1.83 10.67,1.98 12.65,1.98 122.53,32 123.44,32 124.36,32 125.27,32 126.19,32 127.1,32 128.02,32 128.93,32 129.84,32 130.76,32 131.67,32 122.07,31.24 122.99,31.24 123.9,31.24 124.82,31.24 125.73,31.24 126.64,31.24 127.56,31.24 128.47,31.24 129.39,31.24 130.3,31.24 131.22,31.24 132.13,31.24 122.53,30.48 123.44,30.48 124.36,30.48 125.27,30.48 126.19,30.48 127.1,30.48 128.02,30.48 128.93,30.48 129.84,30.48 130.76,30.48 131.67,30.48 122.07,29.72 122.99,29.72 123.9,29.72 124.82,29.72 125.73,29.72 126.64,29.72 127.56,29.72 128.47,29.72 129.39,29.72 130.3,29.72 131.22,29.72 132.13,29.72 122.53,28.96 123.44,28.96 124.36,28.96 125.27,28.96 126.19,28.96 127.1,28.96 128.02,28.96 128.93,28.96 129.84,28.96 130.76,28.96 131.67,28.96
  pour Top (rank 6, no thermals): 145.54,0.3 0.3,0.3 0.3,72.24 145.54,72.24
  pour Bottom (rank 6, no thermals): 145.54,0.3 0.3,0.3 0.3,72.24 145.54,72.24
GVDD  (9 unrouted)
  Top 0.305: U$1.6 U$1.7 27.83,25.85 27.58,25.6 27.58,24.85 C28.P$1 R16.P$2
MUTE  (8 unrouted)
  Top 0.305: U$1.3 U$1.2 24.58,26.02 24.84,25.76 24.84,25.16
N$1  (1 unrouted)
N$2  (1 unrouted)
N$3  (1 unrouted)
N$4  (2 unrouted)
N$6  (1 unrouted)
N$7  (2 unrouted)
N$29  (1 unrouted)
N$30  (1 unrouted)
N$31  (1 unrouted)
N$32  (1 unrouted)
N$37  (2 unrouted)
N$38  (1 unrouted)
N$50  (1 unrouted)
N$51  (1 unrouted)
N$56  (2 unrouted)
N$57  (1 unrouted)
N$58  (1 unrouted)
PVCC  (via drill 0.33)  (31 unrouted)
  other vias: 22.71,35.51 22.25,36.27 34.29,35.51 21.34,36.27 21.79,35.51 35.2,35.51 35.81,36.12 34.9,36.27 21.79,37.03 35.51,37.03
  pour Bottom (no thermals): 20.73,37.64 36.42,37.64 36.42,35.97 35.36,34.9 21.64,34.9 20.73,35.81
  pour Top (no thermals): 24.69,33.38 24.69,35.2 22.25,37.64 16,37.64 15.24,36.88 15.24,29.41 18.44,29.41 19.2,30.18 19.2,32.31 19.81,32.92 22.4,32.92 22.86,33.38
  pour Top (no thermals): 32.16,33.38 32.16,35.05 34.75,37.64 41.61,37.64 42.37,36.88 42.37,29.41 39.01,29.41 38.25,30.18 38.25,32 37.64,32.61 34.75,32.61 33.99,33.38
REAR_BSNL
  Top 0.254: U$6.20 87.96,35.23 88.7,35.97 89.76,35.97 94.34,40.54 94.34,41.29 C50.P$1
REAR_BSNR
  Top 0.254: U$6.26 84.06,39.82 C46.P$1
REAR_BSPL
  Top 0.254: U$6.24 85.36,39.17 C48.P$1
REAR_BSPR
  Top 0.254: U$6.30 81.46,35.27 80.77,35.97 80.16,35.97 75.74,40.39 75.74,41.29 C44.P$1
REAR_LEFT+
  pour Top (no thermals): 94.64,60.66 94.64,63.25 97.23,65.84 97.54,65.84 98.15,66.45 98.15,71.63 97.54,72.24 93.27,72.24 89.15,68.12 89.15,60.66
REAR_LEFT-
  pour Top (no thermals): 108.81,60.66 108.81,68.12 104.7,72.24 100.43,72.24 99.82,71.63 99.82,66.45 100.43,65.84 100.74,65.84 103.33,63.25 103.33,60.66
REAR_OUTNL
  pour Top (no thermals): 87.48,33.53 87.48,35.36 92.96,40.84 92.96,45.26 93.57,45.87 103.94,45.87 108.81,50.75 108.81,54.56 103.33,54.56 103.33,50.75 101.04,48.46 94.18,48.46 91.74,46.02 91.74,41 87.17,36.42 87.17,33.53
REAR_OUTNR
  pour Top (no thermals): 83.29,33.53 83.29,36.65 80.16,39.78 80.16,47.7 78.03,49.83 76.2,49.83 75.29,50.75 75.29,54.56 80.77,54.56 81.38,53.95 81.38,39.62 83.67,37.34 83.67,33.53
REAR_OUTPL
  pour Top (no thermals): 85.88,33.53 85.88,37.87 88.7,40.69 88.7,54.56 94.79,54.56 94.79,50.75 93.88,49.83 92.66,49.83 89.92,47.09 89.92,40.69 86.11,36.88 86.11,33.53
REAR_OUTPR
  pour Top (no thermals): 81.99,33.53 81.99,35.51 77.11,40.39 77.11,45.26 75.74,46.63 65.23,46.63 61.26,50.6 61.26,54.56 67.36,54.56 67.97,53.95 67.97,50.14 69.65,48.46 75.13,48.46 78.33,45.26 78.33,40.08 82.3,36.12 82.3,33.53
REAR_RIGHT+
  pour Top (no thermals): 66.45,60.66 66.45,63.25 69.04,65.84 69.34,65.84 69.95,66.45 69.95,71.63 69.34,72.24 65.07,72.24 60.96,68.12 60.96,60.66
REAR_RIGHT-
  pour Top (no thermals): 80.77,60.66 80.77,68.12 76.66,72.24 72.39,72.24 71.78,71.63 71.78,66.45 72.39,65.84 72.69,65.84 75.29,63.25 75.29,60.66
SYNC
  Top 0.254: U$1.16 33.68,25.91 34.75,24.84 34.75,22.71 35.2,22.25 R13.P$2
SYNC_1  (2 unrouted)
SYNC_2  (2 unrouted)
SYNC_3  (1 unrouted)

### Text on the board
tPlace: R+ | R- | L+ | L- | + | + | - | - | -